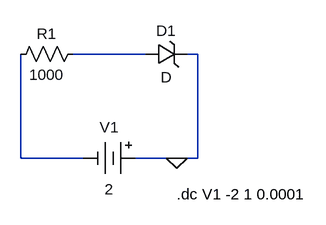
[diagram p0: schematic VI_Diode_zener_Reverse.asc]
VI_Diode_zener_Reverse.asc, the LTspice schematic file:
Version 4
SHEET 1 880 680
WIRE 256 112 144 112
WIRE 336 112 320 112
WIRE 64 272 64 112
WIRE 160 272 64 272
WIRE 304 272 240 272
WIRE 336 272 336 112
WIRE 336 272 304 272
FLAG 304 272 0
SYMBOL res 160 96 R90
WINDOW 0 0 56 VBottom 2
WINDOW 3 32 56 VTop 2
SYMATTR InstName R1
SYMATTR Value 1000
SYMBOL zener 256 128 R270
WINDOW 0 36 32 VTop 2
WINDOW 3 -4 32 VBottom 2
SYMATTR InstName D1
SYMBOL Misc\\battery 256 272 R90
WINDOW 0 -32 56 VBottom 2
WINDOW 3 32 56 VTop 2
SYMATTR InstName V1
SYMATTR Value 2
TEXT 304 328 Left 2 !.dc V1 -2 1 0.0001

The netlist it stands for:
* VI_Diode_zener_Reverse.asc
R1 N001 N002 1000
D1 N001 0 D
V1 0 N002 2
.model D D
.lib standard.dio
.dc V1 -2 1 0.0001
.backanno
.end